# EAGLE design Grove - Q Touch Sensor v1.0 (EAGLE 6.4)

## Sheet 1 of 2
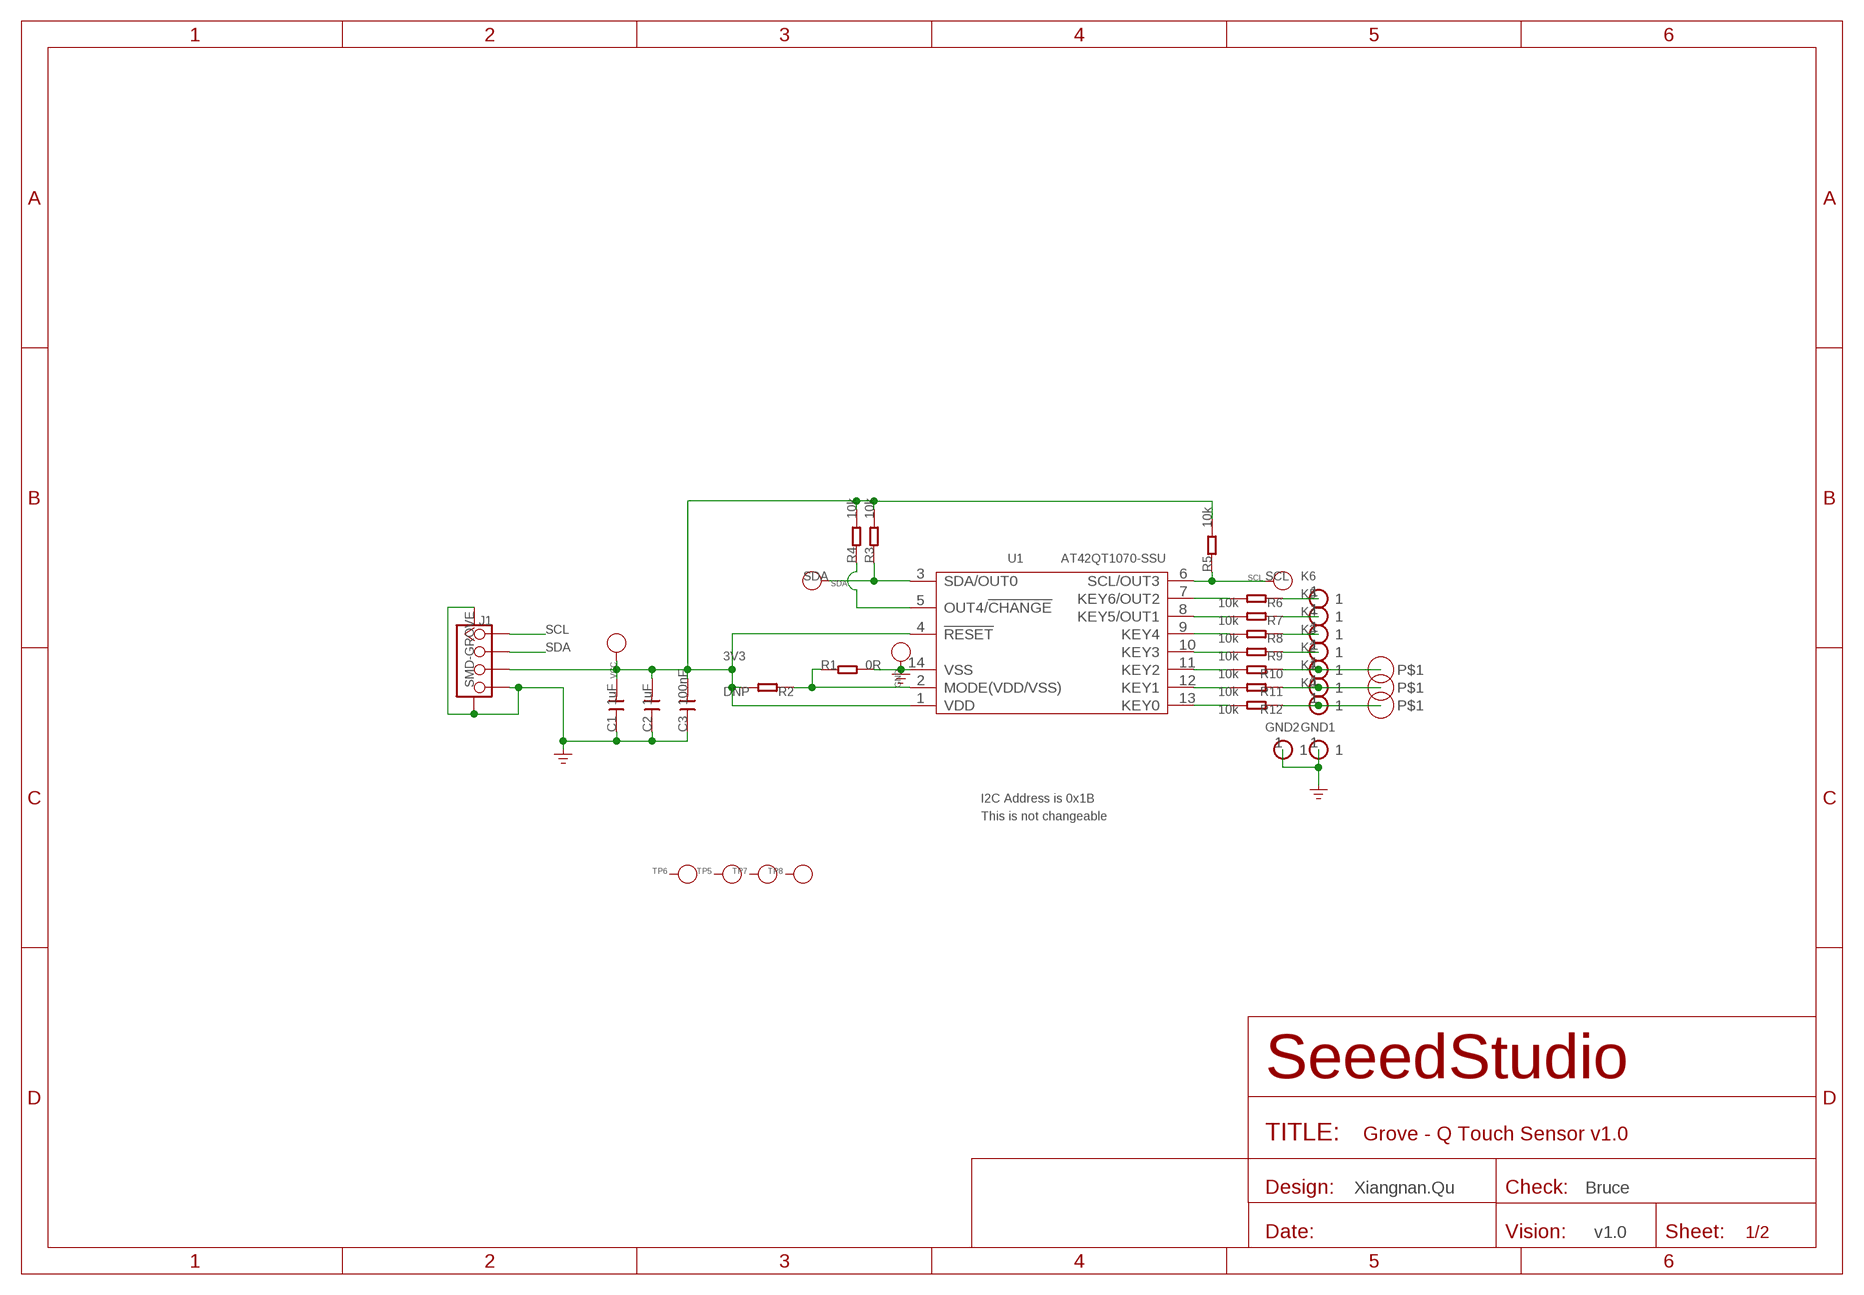
[diagram p0: schematic, sheet 1]

### Parts
C1  1uF  C-0603  [C0603]
C2  1uF  C-0603  [C0603]
C3  100nF  C-0603  [C0603]
GND  PAD-TEST-POINT'4545'  [TP_4545]
GND1  HEADER-1P-35  [1P-65/35MIL]
GND2  HEADER-1P-35  [1P-65/35MIL]
J1  SMD-GROVE  TWIG-4P-2.0-SMD-FEMALE-REINFORCE'DD'  [4P-SMD-2.0]
K0  HEADER-1P-35  [1P-65/35MIL]
K1  HEADER-1P-35  [1P-65/35MIL]
K2  HEADER-1P-35  [1P-65/35MIL]
K3  HEADER-1P-35  [1P-65/35MIL]
K4  HEADER-1P-35  [1P-65/35MIL]
K5  HEADER-1P-35  [1P-65/35MIL]
K6  HEADER-1P-35  [1P-65/35MIL]
P1  PAD-HOLE  [1P-D6MM]
P2  PAD-HOLE  [1P-D6MM]
P3  PAD-HOLE  [1P-D6MM]
R1  0R  R-0603  [R0603]
R2  DNP  R-0603  [R0603]
R3  10k  R-0603  [R0603]
R4  10k  R-0603  [R0603]
R5  10k  R-0603  [R0603]
R6  10k  R-0603  [R0603]
R7  10k  R-0603  [R0603]
R8  10k  R-0603  [R0603]
R9  10k  R-0603  [R0603]
R10  10k  R-0603  [R0603]
R11  10k  R-0603  [R0603]
R12  10k  R-0603  [R0603]
SCL  PAD-TEST-POINT'4545'  [TP_4545]
SDA  PAD-TEST-POINT'4545'  [TP_4545]
TP5  PAD-TEST-POINT'4545'  [TP_4545]
TP6  PAD-TEST-POINT'4545'  [TP_4545]
TP7  PAD-TEST-POINT'4545'  [TP_4545]
TP8  PAD-TEST-POINT'4545'  [TP_4545]
U1  AT42QT1070-SSU  AT42QT1070SSU  [SOIC14]
VCC  PAD-TEST-POINT'4545'  [TP_4545]

### Nets
3V3: C1.2 C2.2 C3.2 J1.3 R2.2 R3.2 R4.2 R5.2 U1.1(VDD) U1.4(!RESET) VCC.T
GND: C1.1 C2.1 C3.1 GND1.1 GND2.1 GND.T J1.4 J1.SS1 J1.SS2 R1.2 U1.14(VSS)
N$1: R1.1 R2.1 U1.2(MODE(VDD/VSS))
N$2: R6.2 U1.7(KEY6/OUT2)
N$3: K6.1 R6.1
N$4: R7.2 U1.8(KEY5/OUT1)
N$5: R8.2 U1.9(KEY4)
N$6: R9.2 U1.10(KEY3)
N$7: R10.2 U1.11(KEY2)
N$8: R11.2 U1.12(KEY1)
N$9: R12.2 U1.13(KEY0)
N$10: R4.1 U1.5(OUT4/!CHANGE)
N$11: K5.1 R7.1
N$12: K4.1 R8.1
N$13: K3.1 R9.1
N$14: K2.1 P1.1 R10.1
N$15: K1.1 P2.1 R11.1
N$16: K0.1 P3.1 R12.1
SCL: J1.1 R5.1 SCL.T U1.6(SCL/OUT3)
SDA: J1.2 R3.1 SDA.T U1.3(SDA/OUT0)
Unconnected: TP5.T TP6.T TP7.T TP8.T

### Notes on the sheet
- I2C Address is 0x1B
- This is not changeable
- Xiangnan.Qu | Bruce
- v1.0

## Sheet 2 of 2
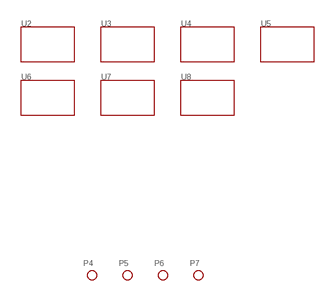
[diagram p1: schematic, sheet 2]

### Parts
P4  PAD-MARK  [ROUND-MARK-1.0]
P5  PAD-MARK  [ROUND-MARK-1.0]
P6  PAD-MARK  [ROUND-MARK-1.0]
P7  PAD-MARK  [ROUND-MARK-1.0]
U2  TWIG'2U'  [GROVE-TEST-PLATFORM]
U3  TWIG'2U'  [GROVE-TEST-PLATFORM]
U4  TWIG'2U'  [GROVE-TEST-PLATFORM]
U5  TWIG'2U'  [GROVE-TEST-PLATFORM]
U6  TWIG'2U'  [GROVE-TEST-PLATFORM]
U7  TWIG'2U'  [GROVE-TEST-PLATFORM]
U8  TWIG'2U'  [GROVE-TEST-PLATFORM]

## Library data of the parts
C1-C3 = Discrete:C*: Ceramic Capacitors
GND SCL SDA TP5-TP8 VCC = Discrete:PAD-TEST-POINT; PARTNO: DNP
GND1 GND2 K0 K1-K6 = Connector :HEADER-1P
J1 = Connector :TWIG-4P-2.0-SMD-FEMALE-REINFORCE
P1-P3 = Discrete:PAD-HOLE
P4-P7 = Discrete:PAD-MARK; PARTNO: DNP
R1-R12 = Discrete:R*
U1 = template :AT42QT1070SSU: Seven-channel QTouch® Touch Sensor IC
U2-U8 = template:TWIG

## Board
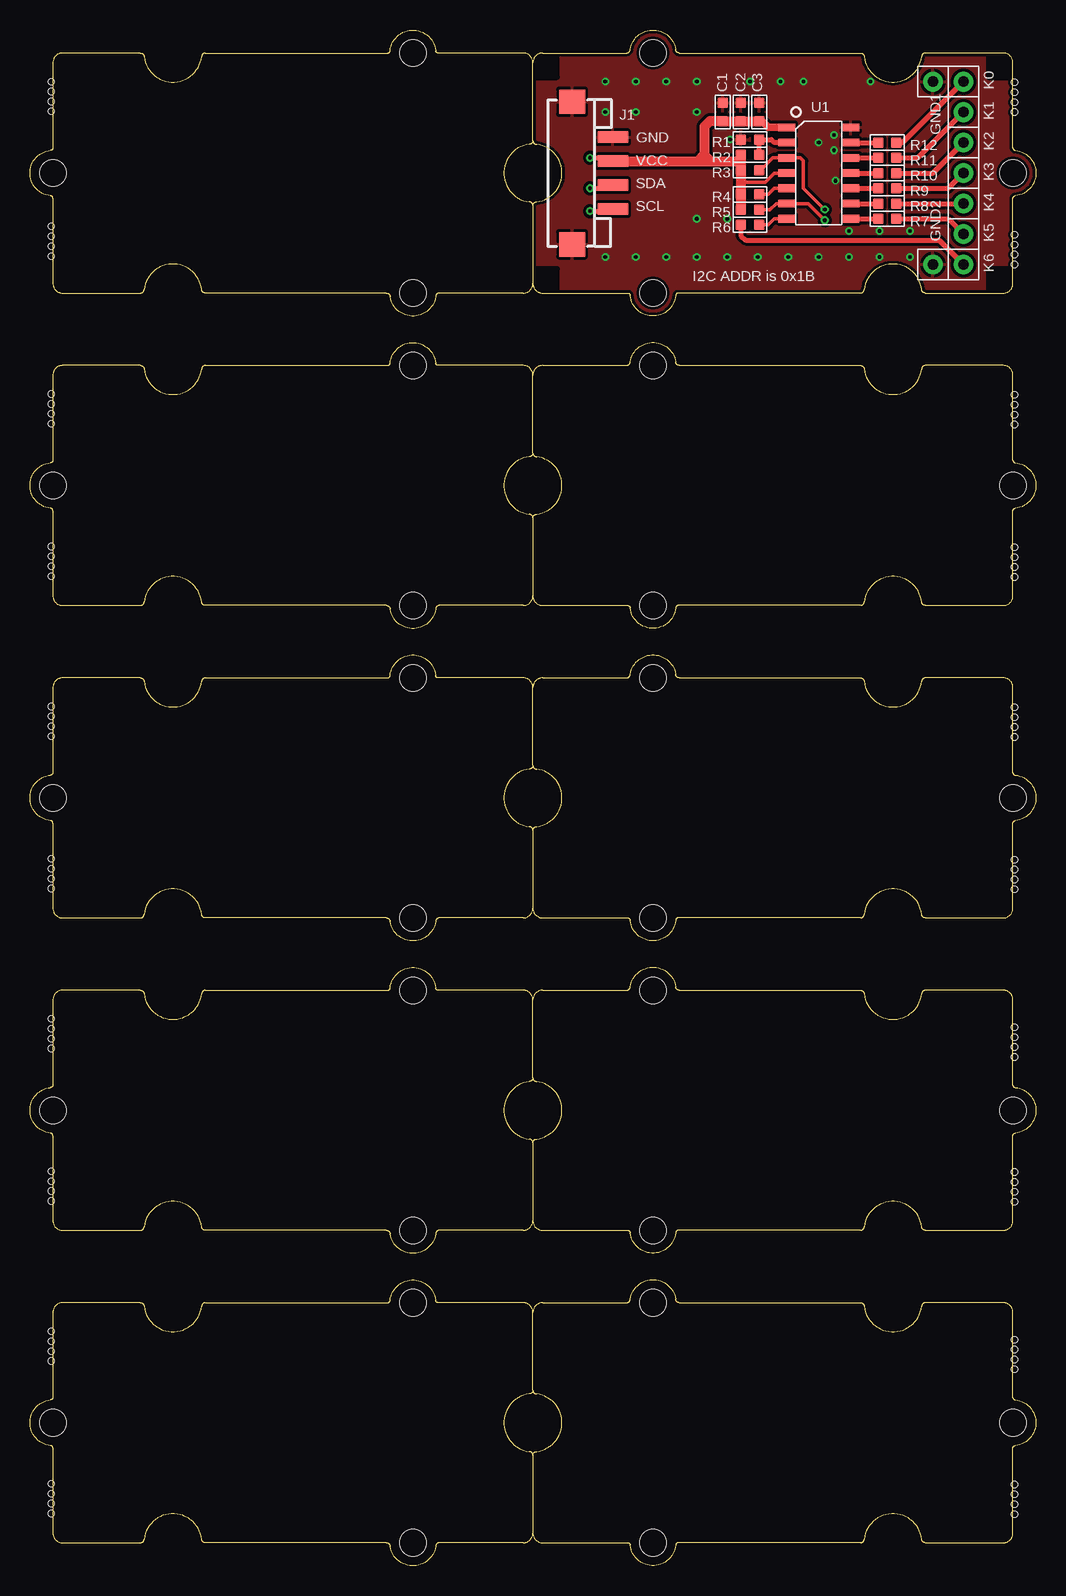
[diagram p2: board, top side]
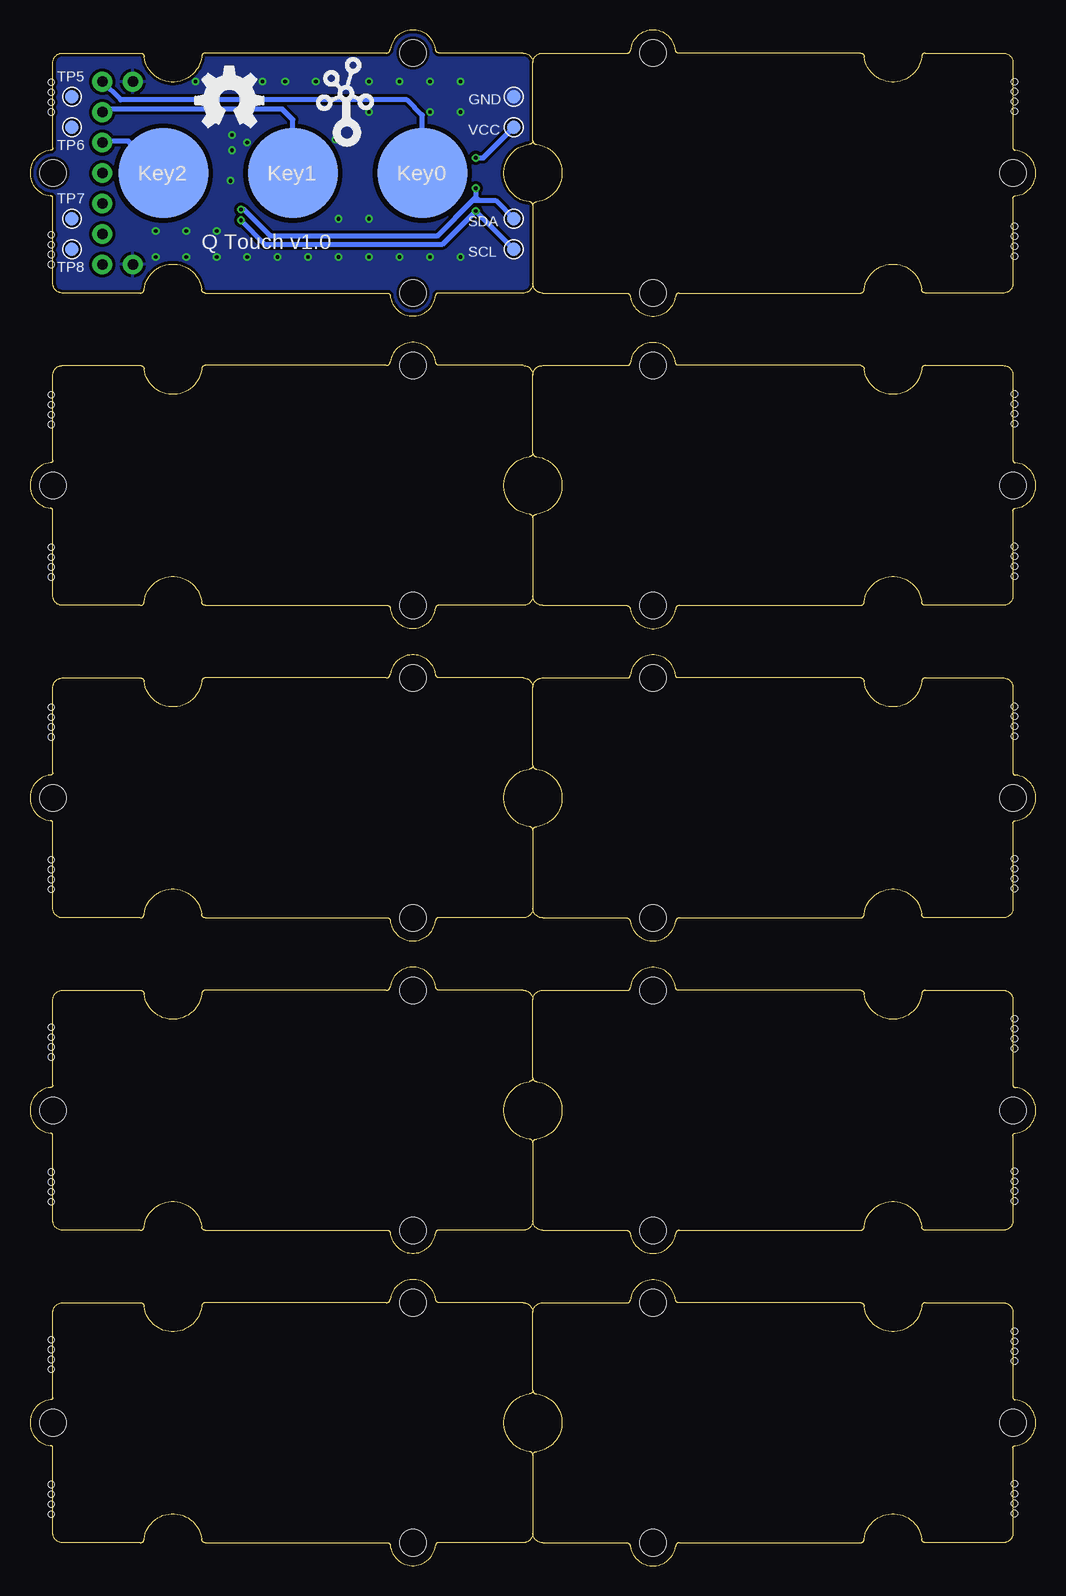
[diagram p3: board, bottom side, seen from below]

Size 83.82 x 127.98 mm. Coordinates in mm from the lower left corner, seen from the top.
Copper layers (1*16): Top 0.035mm / dielectric 1.5mm / Bottom 0.035mm
Design rules "SeeedStudio_2layer_DRU_no_angle_20140221 *": minimum track width 6mil, minimum drill 12mil, track to track 6mil, track to pad 6mil, pad to pad 6mil, via to via 6mil, smd to smd 0mil, copper to edge 10mil, drill to drill 10mil, minimum pad ring 10mil, minimum via ring 6mil, stop-mask expansion 2mil, vias tented up to drill 25mil, thermal gap 10mil
Holes 0.5 mm at 1.78,32.88 1.78,30.4 1.78,31.23 1.78,32.05 1.78,45.58 1.78,43.1 1.78,43.93 1.78,44.75 1.78,58.91 1.78,56.43 1.78,57.26 1.78,58.09 1.78,71.61 1.78,69.13 1.78,69.96 1.78,70.79 1.78,84.95 1.78,82.47 1.78,83.3 1.78,84.12 1.78,97.65 1.78,95.17 1.78,96 1.78,96.82 1.78,111.62 1.78,109.14 1.78,109.97 1.78,110.79 1.78,123.68 1.78,121.2 1.78,122.03 1.78,122.86 82.04,121.14 82.04,123.62 82.04,122.79 82.04,121.97 82.04,108.44 82.04,110.92 82.04,110.09 82.04,109.27 82.04,95.11 82.04,97.58 82.04,96.76 82.04,95.93 82.04,82.41 82.04,84.88 82.04,84.06 82.04,83.23 82.04,69.07 82.04,71.55 82.04,70.72 82.04,69.9 82.04,56.37 82.04,58.85 82.04,58.02 82.04,57.2 82.04,42.4 82.04,44.88 82.04,44.05 82.04,43.23 82.04,30.34 82.04,32.81 82.04,31.99 82.04,31.16 1.78,6.84 1.78,4.36 1.78,5.19 1.78,6.02 1.78,19.54 1.78,17.06 1.78,17.89 1.78,18.72 82.04,16.37 82.04,18.84 82.04,18.02 82.04,17.19 82.04,4.3 82.04,6.78 82.04,5.95 82.04,5.13
Holes 1.91 mm at -4.13,2.4 87.95,2.4 87.95,125.59 -4.13,125.59

### Footprints (pad centres in the part's own frame; a part is rotated, then mirrored left to right if it is on the bottom)
C0603 = smd 0.889 x 0.889: 1 -0.762,0; 2 0.762,0
TP_4545 = smd 1.143 x 1.143: T 0,0
1P-65/35MIL = drill 0.889 pad 1.651: 1 0,0
4P-SMD-2.0 = smd 0.965 x 2.54: 1 -3,0; 2 -1,0; 3 1,0; 4 3,0 | smd 2.032 x 2.184: SS1 -5.946,3.4; SS2 5.946,3.4
1P-D6MM = smd 7.5 x 7.5: 1 0,0
ROUND-MARK-1.0 = smd 1.016 x 1.016: P$1 0,0
R0603 = smd 0.889 x 0.889: 1 -0.762,0; 2 0.762,0
SOIC14 = smd 0.635 x 1.397: 1 -3.81,-2.667; 2 -2.54,-2.667; 3 -1.27,-2.667; 4 0,-2.667; 5 1.27,-2.667; 6 2.54,-2.667; 7 3.81,-2.667; 8 3.81,2.667; 9 2.54,2.667; 10 1.27,2.667; 11 0,2.667; 12 -1.27,2.667; 13 -2.54,2.667; 14 -3.81,2.667
GROVE-TEST-PLATFORM = hole 2.2: -10,-10; -10,10; 20,0
GROVE-2CONNECTOR-SMD = hole 2.2: -10,-10; -10,10; 20,0

### Placement (x,y rotation side)
C1  57.72,121.14 270 top
C2  59.25,121.14 270 top
C3  60.77,121.14 270 top
GND  43.5,122.41 0 bottom
GND1  75.25,123.68 0 top
GND2  75.25,108.44 0 top
J1  48.58,116.06 90 top
K0  77.79,123.68 0 top
K1  77.79,121.14 0 top
K2  77.79,118.6 0 top
K3  77.79,116.06 0 top
K4  77.79,113.52 0 top
K5  77.79,110.98 0 top
K6  77.79,108.44 0 top
P1  72.71,116.06 0 bottom
P2  61.91,116.06 0 bottom
P3  51.12,116.06 0 bottom
P4  -4.13,7.48 0 top  (outside the outline)
P5  87.95,7.48 0 top  (outside the outline)
P6  -4.13,120.51 0 top  (outside the outline)
P7  87.95,120.51 0 top  (outside the outline)
R1  60.01,118.86 180 top
R2  60.01,117.59 180 top
R3  60.01,116.32 180 top
R4  60.01,114.28 180 top
R5  60.01,113.01 180 top
R6  60.01,111.74 0 top
R7  71.44,112.25 180 top
R8  71.44,113.52 180 top
R9  71.44,114.79 180 top
R10  71.44,116.06 180 top
R11  71.44,117.33 180 top
R12  71.44,118.6 180 top
SCL  43.5,109.71 0 bottom
SDA  43.5,112.25 0 bottom
TP5  80.33,122.41 0 bottom
TP6  80.33,119.87 0 bottom
TP7  80.33,112.25 0 bottom
TP8  80.33,109.71 0 bottom
U1  65.72,116.06 270 top
U2  61.91,37.96 0 top
U3  21.91,37.96 180 top
U4  61.91,63.99 0 top
U5  21.91,63.99 180 top
U6  61.91,90.03 0 top
U7  21.91,90.03 180 top
U8  21.91,116.06 180 top
U10  [GROVE-TEST-PLATFORM]  61.91,11.92 0 top
U11  [GROVE-TEST-PLATFORM]  21.91,11.92 180 top
U$5  [GROVE-2CONNECTOR-SMD]  61.91,116.06 0 top
U$6  [OSHW_FILLX200_NOTEXT]  70.04,119.87 0 bottom
U$7  [TWIGLOGO]  57.47,119.24 0 bottom
VCC  43.5,119.87 0 bottom

### Tracks (layer width: path | path; a pad name or v marks a point on that pad's centre or on a via)
3V3  (via drill 0.3 pad 0.64)
  Top 0.305: U1.4 62.04,116.06 61.28,115.3 59.63,115.3 | 59.63,115.3 59.37,115.55 59.25,115.55 | 59.63,115.3 59.37,115.05
  Top 0.406: v46.67,117.33 48.31,117.33 J1.3
  Top 0.61: U1.1 61.53,119.87 61.02,120.38 C3.2
  Top 0.813: J1.3 55.69,117.06 | C3.2 C2.2 C1.2 56.66,120.38 56.2,119.92 56.2,117.59 | 56.2,117.59 56.2,117.57 55.69,117.06 | R2.2 59.25,116.95 | 59.25,116.95 R3.2 59.25,115.55 R4.2 R5.2 | 55.69,117.06 59.14,117.06 59.25,116.95 | 56.2,117.59 56.71,117.08
  Bottom 0.406: v46.67,117.33 46.04,117.33 VCC.T
GND  (via drill 0.3 pad 0.64)
  other vias: 58.36,118.86 55.56,121.14 55.56,123.68 53.02,123.68 50.48,123.68 50.48,121.14 60.01,123.68 62.55,123.68 64.45,123.68 65.72,118.6 66.99,119.24 66.99,117.97 67.12,115.43 68.26,111.24 70.8,111.24 73.34,111.24 70.04,123.68 55.56,112.25 58.1,112.25 50.48,109.08 53.02,109.08 55.56,109.08 58.1,109.08 60.64,109.08 63.18,109.08 65.72,109.08 68.26,109.08 70.8,109.08 73.34,109.08 47.94,121.14 47.94,123.68 47.94,109.08
  pour Top (isolate 0.254): 41.59,128.13 84.14,128.13 84.14,105.9 84.14,104 41.59,104
  pour Bottom (isolate 0.254): 41.59,128.13 84.14,128.13 84.14,105.9 84.14,104 41.59,104
N$1
  Top 0.406: R2.1 R1.1 61.79,118.86 61.98,118.66 62.04,118.6 U1.2
N$2
  Top 0.305: U1.7 62.04,112.25 61.53,111.74 R6.2
N$3
  Top 0.406: K6.1 75.76,110.47 59.63,110.47 59.25,110.85 R6.1
N$4
  Top 0.406: U1.8 R7.2
N$5
  Top 0.406: U1.9 R8.2
N$6
  Top 0.406: U1.10 R9.2
N$7
  Top 0.406: U1.11 R10.2
N$8
  Top 0.406: U1.12 R11.2
N$9
  Top 0.406: U1.13 R12.2
N$10
  Top 0.305: U1.5 62.04,114.79 61.53,114.28 R4.1
N$11
  Top 0.406: R7.1 76.52,112.25 K5.1
N$12
  Top 0.406: R8.1 K4.1
N$13
  Top 0.406: R9.1 76.52,114.79 K3.1
N$14
  Top 0.406: R10.1 75.25,116.06 K2.1
  Bottom 0.406: P1.1 72.96,116.06 75.63,118.73 77.66,118.73 K2.1
N$15
  Top 0.406: R11.1 73.98,117.33 K1.1
  Bottom 0.406: P2.1 61.91,120.51 62.8,121.39 77.54,121.39 K1.1
N$16
  Top 0.406: R12.1 72.71,118.6 K0.1
  Bottom 0.406: K0.1 76.26,122.16 52.39,122.16 51.12,120.89 P3.1
SCL  (via drill 0.3 pad 0.64)
  Top 0.305: R5.1 61.66,113.01 62.17,113.52 U1.6 64.83,113.52 v66.23,112.12
  Top 0.406: v46.67,112.89 48.4,112.89 J1.1
  Bottom 0.406: SCL.T v46.67,112.89 49.47,110.09 64.2,110.09 v66.23,112.12
SDA  (via drill 0.3 pad 0.64)
  Top 0.305: R3.1 60.9,116.32 61.91,117.33 U1.3 64.2,117.33 64.45,117.08 64.45,114.79 v66.23,113.01
  Top 0.406: v46.67,114.79 48.31,114.79 J1.2
  Bottom 0.406: SDA.T 45.02,113.78 46.42,113.78 | v66.23,113.01 65.98,113.01 63.77,110.81 49.9,110.81 46.93,113.78 | 46.93,113.78 46.42,113.78 | v46.67,114.79 46.67,114.16 46.67,114.03 | 46.67,114.03 46.93,113.78 | 46.67,114.03 46.42,113.78

### Text on the board
tPlace: GND | VCC | SDA | SCL | I2C ADDR is 0x1B
bPlace: Q Touch v1.0
bNames: Key0 | Key1 | Key2